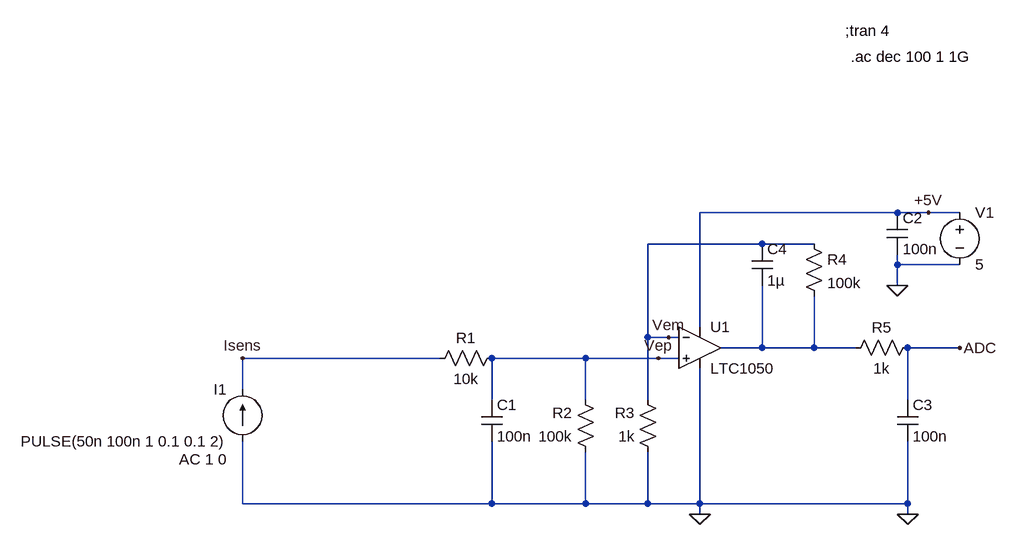
[diagram p0: schematic TP1Capteurs.asc]
TP1Capteurs.asc, the LTspice schematic file:
Version 4
SHEET 1 1136 680
WIRE 976 -80 672 -80
WIRE 1024 -80 976 -80
WIRE 1072 -80 1024 -80
WIRE 768 -32 592 -32
WIRE 848 -32 768 -32
WIRE 976 0 976 -16
WIRE 1072 0 976 0
WIRE 976 32 976 0
WIRE 672 96 672 -80
WIRE 592 112 592 -32
WIRE 624 112 592 112
WIRE 640 112 624 112
WIRE 768 128 768 32
WIRE 768 128 704 128
WIRE 848 128 848 48
WIRE 848 128 768 128
WIRE 912 128 848 128
WIRE 1072 128 992 128
WIRE 272 144 -32 144
WIRE 496 144 352 144
WIRE 608 144 496 144
WIRE 640 144 608 144
WIRE -32 192 -32 144
WIRE 352 208 352 144
WIRE 496 208 496 144
WIRE 592 208 592 112
WIRE 992 208 992 128
WIRE -32 368 -32 272
WIRE 352 368 352 272
WIRE 352 368 -32 368
WIRE 496 368 496 288
WIRE 496 368 352 368
WIRE 592 368 592 288
WIRE 592 368 496 368
WIRE 672 368 672 160
WIRE 672 368 592 368
WIRE 992 368 992 272
WIRE 992 368 672 368
WIRE 672 384 672 368
WIRE 992 384 992 368
FLAG 672 384 0
FLAG 976 32 0
FLAG 992 384 0
FLAG 1072 128 ADC
FLAG -32 144 Isens
FLAG 624 112 Vem
FLAG 608 144 Vep
FLAG 1024 -80 +5V
SYMBOL current -32 272 R180
WINDOW 0 24 80 Left 2
WINDOW 3 24 0 Left 2
WINDOW 123 24 -28 Left 2
WINDOW 39 0 0 Left 0
SYMATTR InstName I1
SYMATTR Value PULSE(50n 100n 1 0.1 0.1 2)
SYMATTR Value2 AC 1 0
SYMBOL res 368 128 R90
WINDOW 0 0 56 VBottom 2
WINDOW 3 32 56 VTop 2
SYMATTR InstName R1
SYMATTR Value 10k
SYMBOL res 512 304 R180
WINDOW 0 36 76 Left 2
WINDOW 3 36 40 Left 2
SYMATTR InstName R2
SYMATTR Value 100k
SYMBOL res 608 304 R180
WINDOW 0 36 76 Left 2
WINDOW 3 36 40 Left 2
SYMATTR InstName R3
SYMATTR Value 1k
SYMBOL res 832 -48 R0
SYMATTR InstName R4
SYMATTR Value 100k
SYMBOL res 1008 112 R90
WINDOW 0 0 56 VBottom 2
WINDOW 3 32 56 VTop 2
SYMATTR InstName R5
SYMATTR Value 1k
SYMBOL cap 336 208 R0
SYMATTR InstName C1
SYMATTR Value 100n
SYMBOL cap 960 -80 R0
SYMATTR InstName C2
SYMATTR Value 100n
SYMBOL cap 976 208 R0
SYMATTR InstName C3
SYMATTR Value 100n
SYMBOL cap 752 -32 R0
SYMATTR InstName C4
SYMATTR Value 1µ
SYMBOL OpAmps\\LTC1050 672 64 R0
SYMATTR InstName U1
SYMBOL voltage 1072 -96 R0
WINDOW 123 0 0 Left 0
WINDOW 39 0 0 Left 0
SYMATTR InstName V1
SYMATTR Value 5
TEXT 896 -360 Left 2 !;tran 4
TEXT 904 -320 Left 2 !.ac dec 100 1 1G

The netlist it stands for:
* TP1Capteurs.asc
I1 0 Isens PULSE(50n 100n 1 0.1 0.1 2) AC 1 0
R1 Vep Isens 10k
R2 0 Vep 100k
R3 0 Vem 1k
R4 Vem N001 100k
R5 ADC N001 1k
C1 Vep 0 100n
C2 +5V 0 100n
C3 ADC 0 100n
C4 Vem N001 1µ
XU1 Vep Vem +5V 0 N001 LTC1050  ; pins In+ In- V+ V- OUT
V1 +5V 0 5
;tran 4
.ac dec 100 1 1G
.lib LTC.lib
.backanno
.end